# EAGLE design maple-protoshield-v0.1 (EAGLE 5.10)
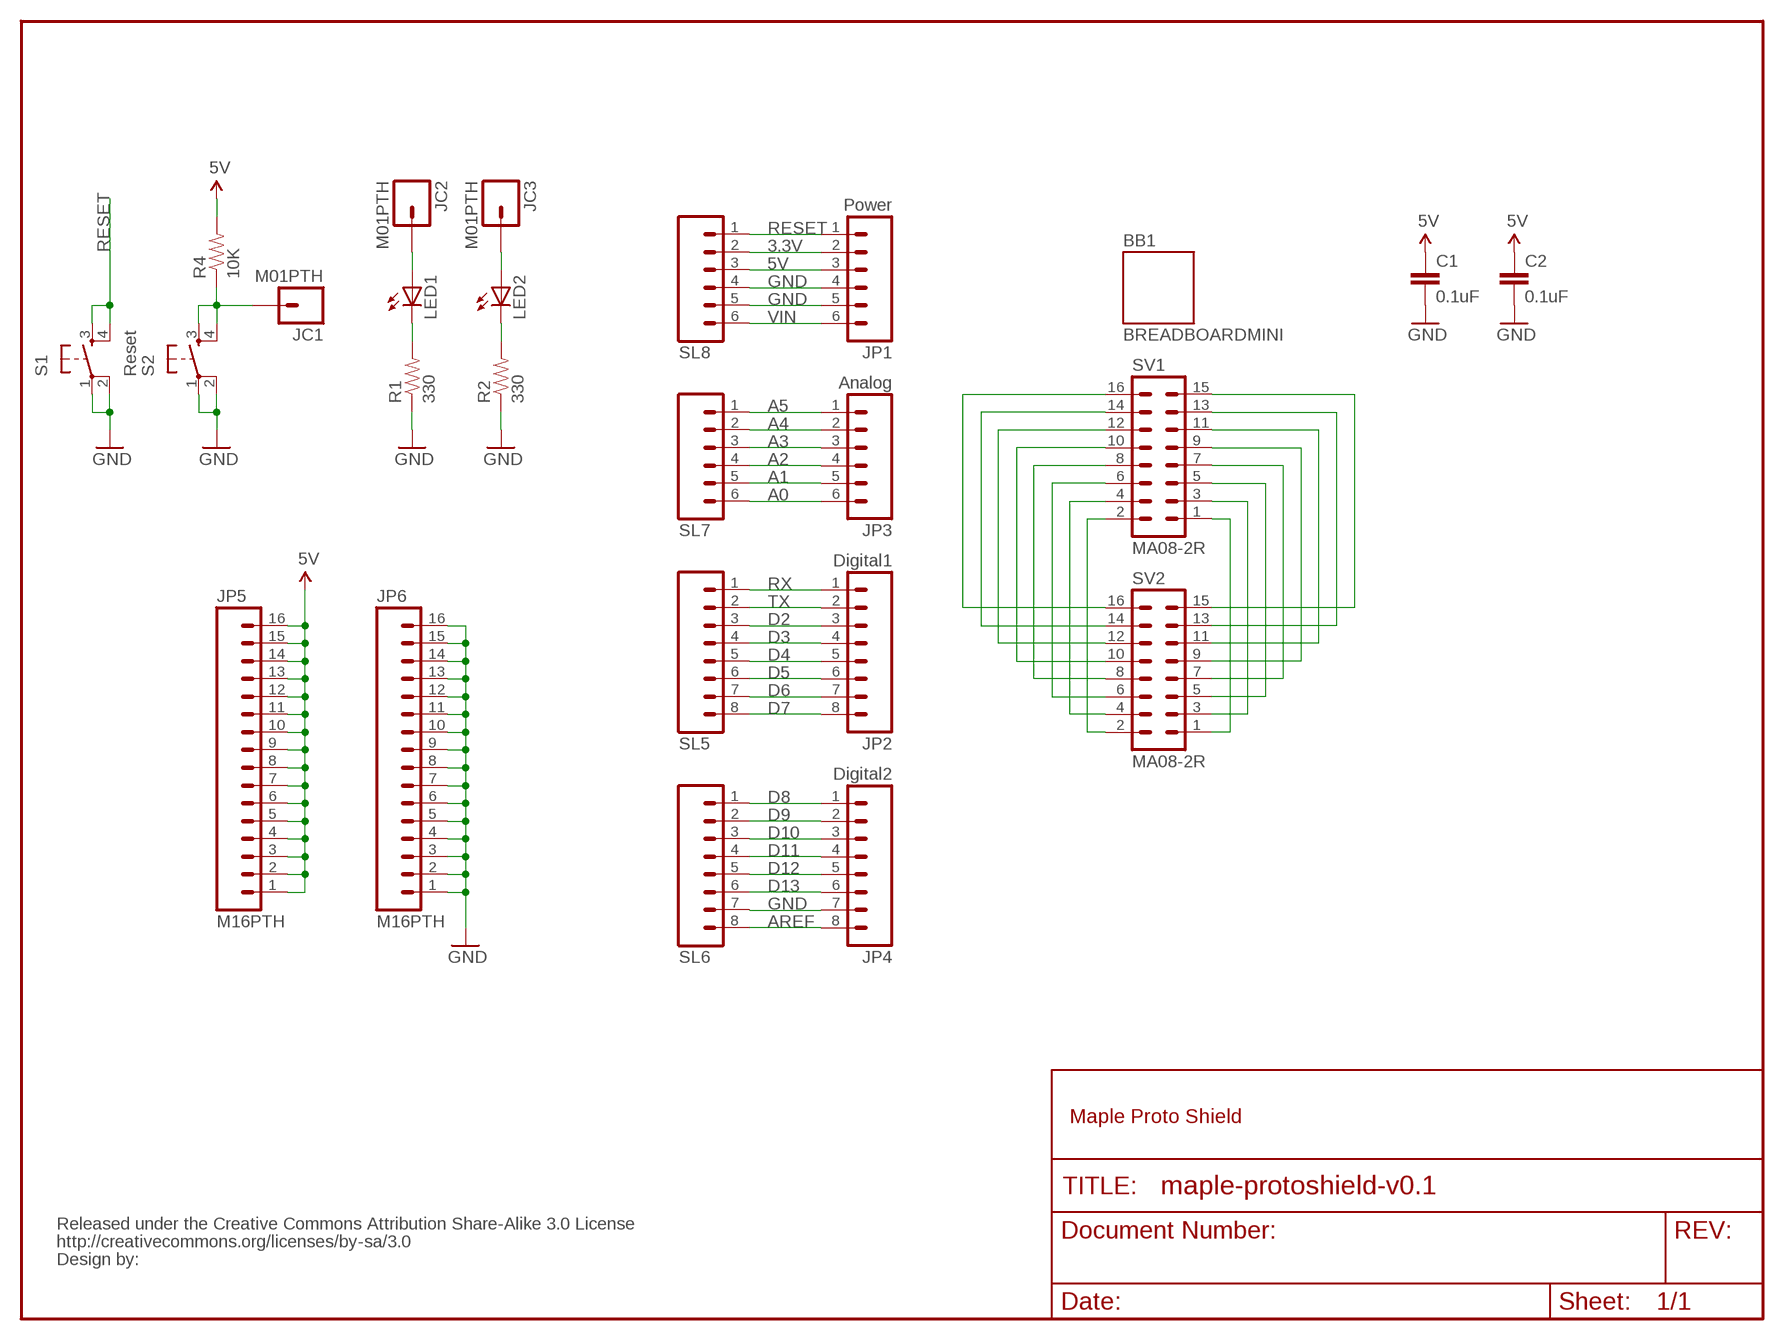
[diagram p0: schematic, sheet 1]

## Parts
BB1  BREADBOARDMINI  [BREADBOARD-MINI]
C1  0.1uF  CAPPTH2  [CAP-PTH-SMALL2]
C2  0.1uF  CAPPTH2  [CAP-PTH-SMALL2]
JC1  M01PTH  [1X01]
JC2  M01PTH  [1X01]
JC3  M01PTH  [1X01]
JP1  Power  M06SIP  [1X06]
JP2  Digital1  M08  [1X08]
JP3  Analog  M06SIP  [1X06]
JP4  Digital2  M08  [1X08]
JP5  M16PTH  [1X16]
JP6  M16PTH  [1X16]
LED1  LED5MM  [LED5MM]
LED2  LED5MM  [LED5MM]
R1  330  RESISTORPTH1  [AXIAL-0.3]
R2  330  RESISTORPTH1  [AXIAL-0.3]
R4  10K  RESISTORPTH1  [AXIAL-0.3]
S1  Reset  TAC_SWITCHPTH  [TACTILE-PTH]
S2  TAC_SWITCHPTH  [TACTILE-PTH]
SL5  M08  [1X08]
SL6  M08  [1X08]
SL7  M06SIP  [1X06]
SL8  M06SIP  [1X06]
SV1  MA08-2R  [MA08-2R]
SV2  MA08-2R  [MA08-2R]
U$2  CREATIVE_COMMONS  [CREATIVE_COMMONS]

## Nets
3.3V: JP1.2 SL8.2
5V [power]: C1.1 C2.1 JP1.3 JP5.1 JP5.2 JP5.3 JP5.4 JP5.5 JP5.6 JP5.7 JP5.8 JP5.9 JP5.10 JP5.11 JP5.12 JP5.13 JP5.14 JP5.15 JP5.16 R4.P$2 SL8.3
A0: JP3.6 SL7.6
A1: JP3.5 SL7.5
A2: JP3.4 SL7.4
A3: JP3.3 SL7.3
A4: JP3.2 SL7.2
A5: JP3.1 SL7.1
AREF: JP4.8 SL6.8
D2: JP2.3 SL5.3
D3: JP2.4 SL5.4
D4: JP2.5 SL5.5
D5: JP2.6 SL5.6
D6: JP2.7 SL5.7
D7: JP2.8 SL5.8
D8: JP4.1 SL6.1
D9: JP4.2 SL6.2
D10: JP4.3 SL6.3
D11: JP4.4 SL6.4
D12: JP4.5 SL6.5
D13: JP4.6 SL6.6
GND [power]: C1.2 C2.2 JP1.4 JP1.5 JP4.7 JP6.1 JP6.2 JP6.3 JP6.4 JP6.5 JP6.6 JP6.7 JP6.8 JP6.9 JP6.10 JP6.11 JP6.12 JP6.13 JP6.14 JP6.15 JP6.16 R1.P$1 R2.P$1 S1.1 S1.2 S2.1 S2.2 SL6.7 SL8.4 SL8.5
N$2: JC1.1 R4.P$1 S2.3 S2.4
N$6: LED1.K(C) R1.P$2
N$7: LED2.K(C) R2.P$2
N$8: JC2.1 LED1.A
N$9: JC3.1 LED2.A
N$39: SV1.1 SV2.1
N$183: SV1.3 SV2.3
N$184: SV1.5 SV2.5
N$185: SV1.7 SV2.7
N$186: SV1.9 SV2.9
N$187: SV1.11 SV2.11
N$188: SV1.13 SV2.13
N$189: SV1.15 SV2.15
N$190: SV1.2 SV2.2
N$191: SV1.4 SV2.4
N$192: SV1.6 SV2.6
N$193: SV1.8 SV2.8
N$194: SV1.10 SV2.10
N$195: SV1.12 SV2.12
N$196: SV1.14 SV2.14
N$197: SV1.16 SV2.16
RESET: JP1.1 S1.3 S1.4 SL8.1
RX: JP2.1 SL5.1
TX: JP2.2 SL5.2
VIN [power]: JP1.6 SL8.6

## Notes on the sheet
- Maple Proto Shield

## Library data of the parts
BB1 = SparkFun:BREADBOARD: Breadboard Mini Self Adhesive This is the mechnical outline for the very small self adhesive breadboard from SparkFun Electronics. Good for very small proto areas. SKU : PRT-07916
C1 C2 = SparkFun:CAP: Capacitor Standard 0603 ceramic capacitor, and 0.1" leaded capacitor.
JC1-JC3 = SparkFun:M01: Header 1 Standard 1-pin 0.1" header. Use with straight break away headers (SKU : PRT-00116), right angle break away headers (PRT-00553), swiss pins (PRT-00743), machine pins (PRT-00117), and female headers (PRT-00115).
JP1 JP3 SL7 SL8 = SparkFun:M06: Header 6 Standard 6-pin 0.1" header. Use with straight break away headers (SKU : PRT-00116), right angle break away headers (PRT-00553), swiss pins (PRT-00743), machine pins (PRT-00117), and female headers (PRT-00115). Molex polarized connector foot print use with SKU : PRT-08094 with associated crimp pins and housings. NOTES ON THE VARIANTS LOCK and LOCK_LONGPADS... This footprint was designed to help hold the alignment of a through-hole component (i.e. 6-pin header) while soldering it into place. You may notice that each hole has been shifted either up or down by 0.005 of an inch from it's more standard position (which is a perfectly straight line). This slight alteration caused the pins (the squares in the middle) to touch the edges of the holes. Because they are alternating, it causes a "brace" to hold the component in place. 0.005 has proven to be the perfect amount of "off-center" position when using our standard breakaway headers. Although looks a little odd when you look at the bare footprint, once you have a header in there, the alteration is very hard to notice. Also, if you push a header all the way into place, it is covered up entirely on the bottom side. This idea of altering the position of holes to aid alignment will be further integrated into the Sparkfun Library for other footprints. It can help hold any component with 3 or more connection pins.
JP2 JP4 SL5 SL6 = SparkFun:M08: Header 8 Standard 8-pin 0.1" header. Use with straight break away headers (SKU : PRT-00116), right angle break away headers (PRT-00553), swiss pins (PRT-00743), machine pins (PRT-00117), and female headers (PRT-00115).
JP5 JP6 = SparkFun:M16
LED1 LED2 = SparkFun:LED: LEDs Standard schematic elements and footprints for 5mm, 3mm, 1206, and 0603 sized LEDs. 5mm - Spark Fun Electronics SKU : COM-00529 (and others)
R1 R2 R4 = SparkFun:RESISTOR: Resistor Basic schematic elements and footprints for 0603, 1206, and PTH 1/10th watt (small) resistors.
S1 S2 = SparkFun:TAC_SWITCH: Momentary Switch Button commonly used for reset or general input. Spark Fun Electronics SKU : COM-00097
SV1 SV2 = con-lstb:MA08-2R: PIN HEADER
U$2 = SparkFun:CREATIVE_COMMONS

## Net classes
1 power: width 0.254 mm

## Board
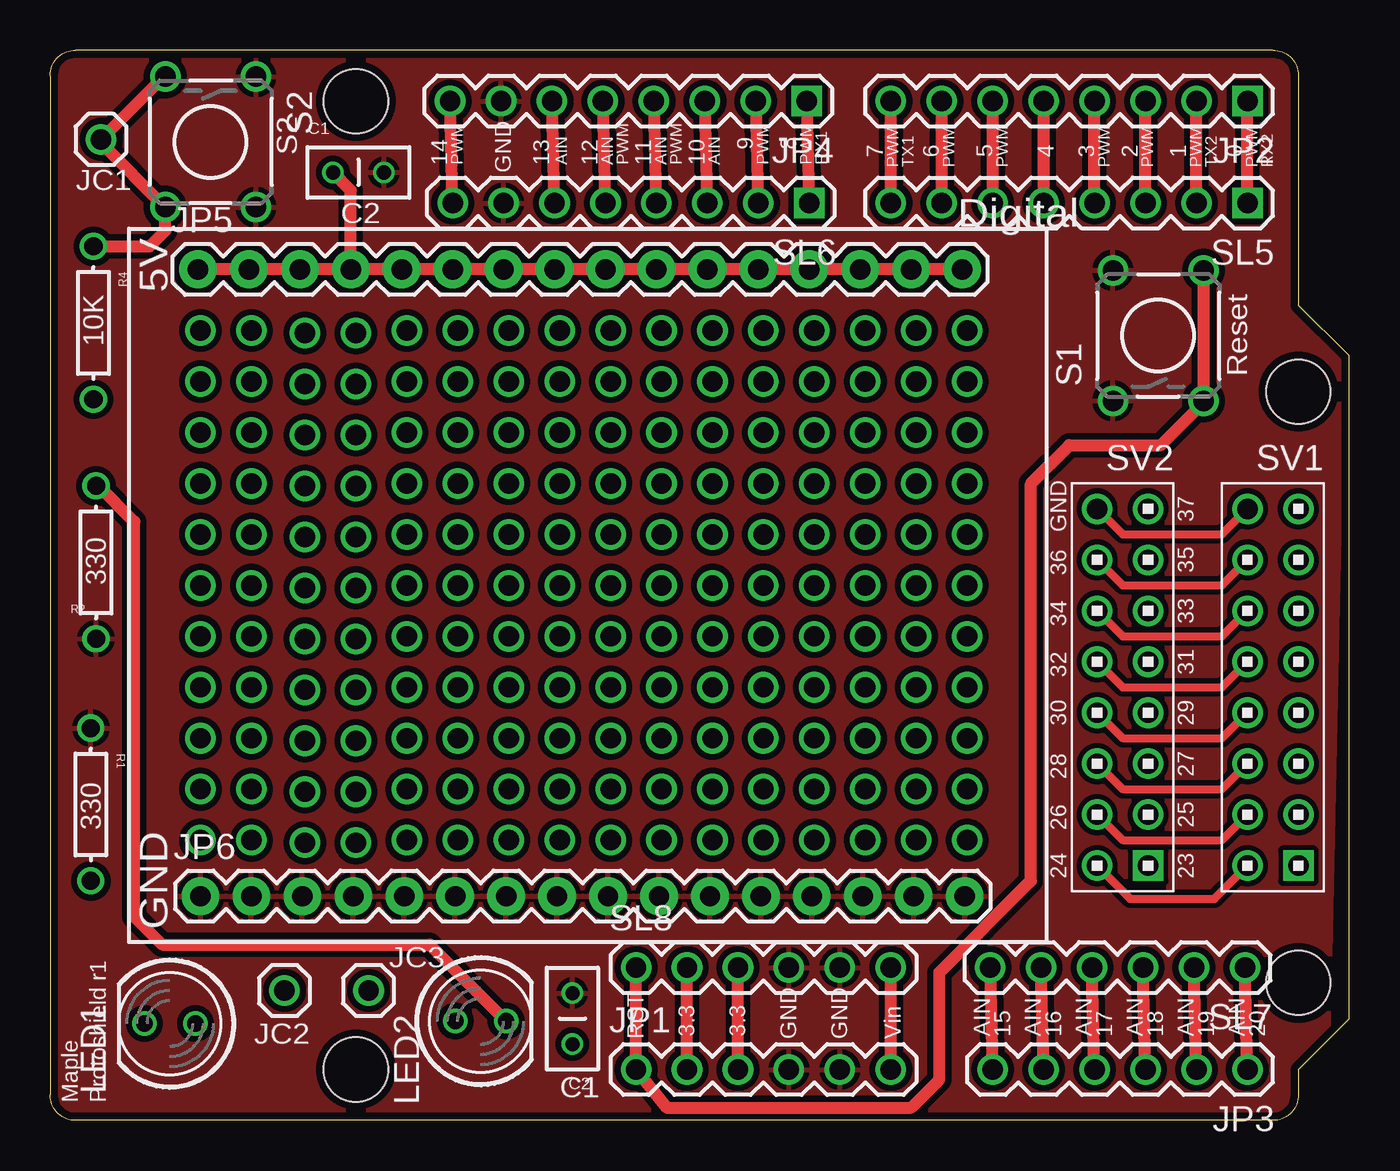
[diagram p1: board, top side]
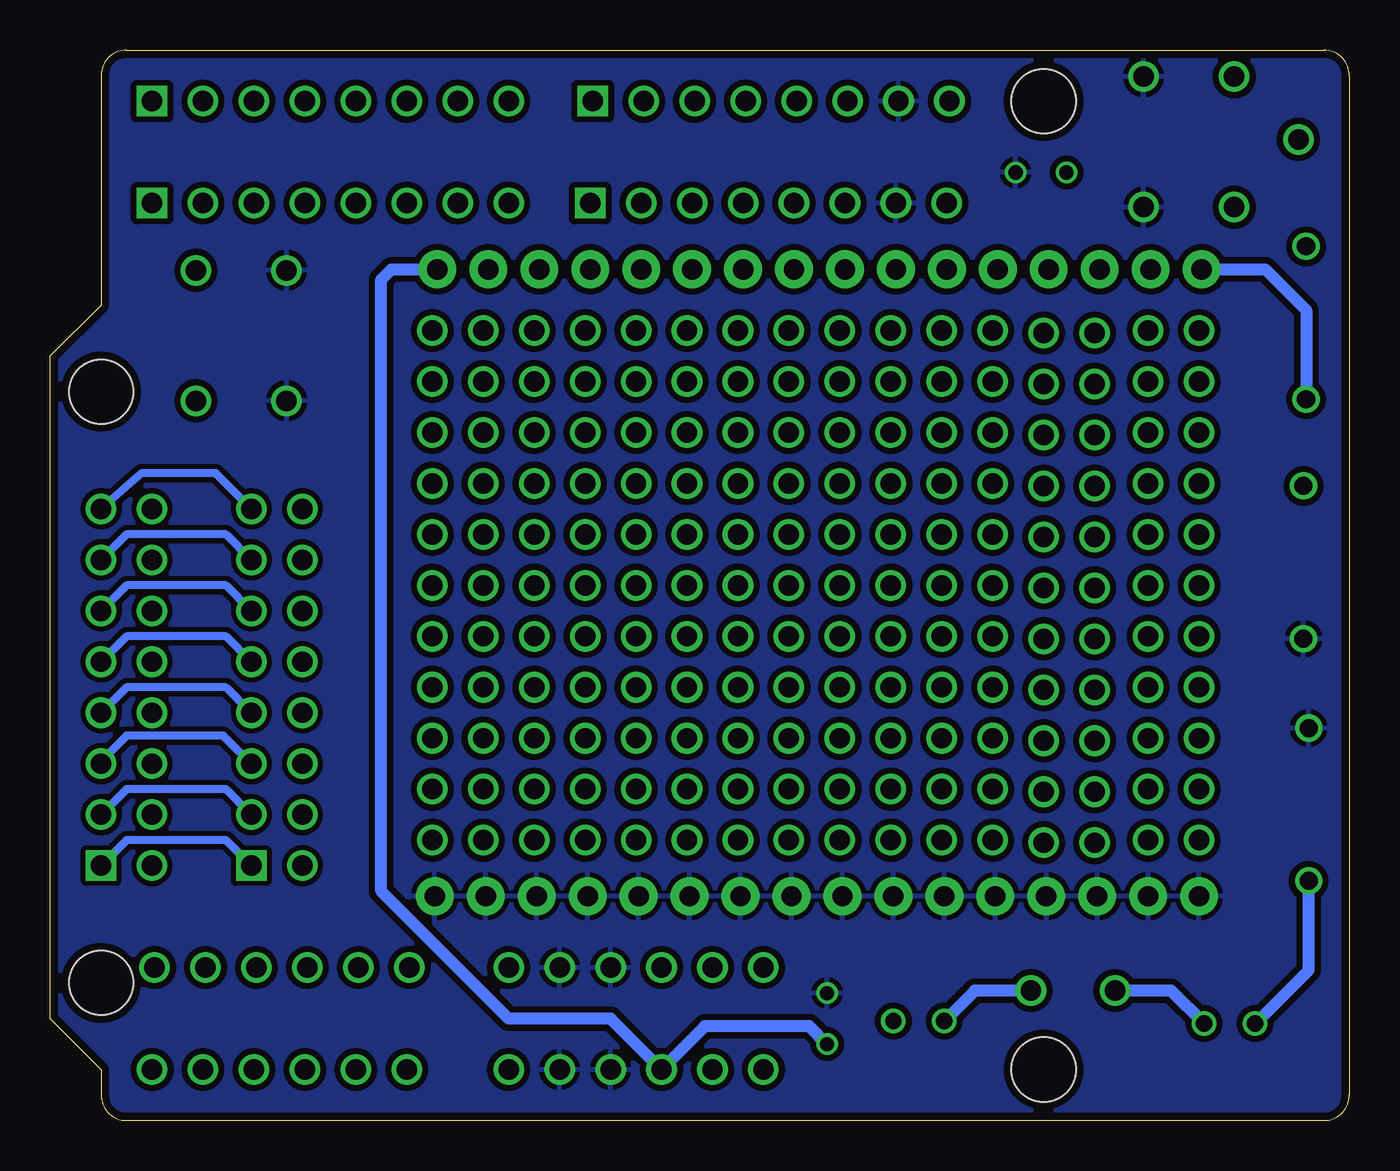
[diagram p2: board, bottom side, seen from below]

Size 64.77 x 53.34 mm. Coordinates in mm from the lower left corner, seen from the top.
Outline: 64.77,38.1 62.23,40.64 62.23,52.07 arc90 60.96,53.34 1.27,53.34 arc90 0,52.07 0,1.27 arc90 1.27,0 60.96,0 arc90 62.23,1.27 62.23,2.54 64.77,5.08 64.77,38.1
Copper layers (1*16): Top 0.0356mm / dielectric 1.5011mm / Bottom 0.0356mm
Design rules "LaenPCBOrder": minimum track width 6mil, minimum drill 13mil, track to track 6mil, track to pad 6mil, pad to pad 6mil, via to via 6mil, smd to smd 6mil, copper to edge 15mil, drill to drill 6mil, minimum pad ring 7mil, minimum via ring 7mil, stop-mask expansion 4mil, vias tented up to drill 0mil, thermal gap 10mil
Holes 3.2 mm at 62.23,6.86 15.24,50.8 62.23,36.32 15.24,2.54

### Footprints (pad centres in the part's own frame; a part is rotated, then mirrored left to right if it is on the bottom)
CAP-PTH-SMALL2 = drill 0.7 round: 1 0,0; 2 2.54,0
1X01 = drill 1.016 round: 1 0,0
1X06 = drill 1.016 round: 1 0,0; 2 2.54,0; 3 5.08,0; 4 7.62,0; 5 10.16,0; 6 12.7,0
1X08 = drill 1.016 square: 1 0,0 | drill 1.016 round: 2 2.54,0; 3 5.08,0; 4 7.62,0; 5 10.16,0; 6 12.7,0; 7 15.24,0; 8 17.78,0
1X16 = drill 1.016 pad 1.88 round: 1 0,0; 2 2.54,0; 3 5.08,0; 4 7.62,0; 5 10.16,0; 6 12.7,0; 7 15.24,0; 8 17.78,0; 9 20.32,0; 10 22.86,0; 11 25.4,0; 12 27.94,0; 13 30.48,0; 14 33.02,0; 15 35.56,0; 16 38.1,0
LED5MM = drill 0.813 round: A -1.27,0; K 1.27,0
AXIAL-0.3 = drill 0.9 round: P$1 -3.81,0; P$2 3.81,0
TACTILE-PTH = drill 1.016 round: 1 -3.251,2.261; 2 3.251,2.261; 3 -3.251,-2.261; 4 3.251,-2.261
MA08-2R = drill 1.016 square: 1 -8.89,-1.27 | drill 1.016 round: 2 -8.89,1.27; 3 -6.35,-1.27; 4 -6.35,1.27; 5 -3.81,-1.27; 6 -3.81,1.27; 7 -1.27,-1.27; 8 -1.27,1.27; 9 1.27,-1.27; 10 1.27,1.27; 11 3.81,-1.27; 12 3.81,1.27; 13 6.35,-1.27; 14 6.35,1.27; 15 8.89,-1.27; 16 8.89,1.27

### Placement (x,y rotation side)
BB1  3.94,8.89 0 top
C1  14.1,47.24 0 top
C2  26.04,3.81 90 top
JC1  2.54,48.89 0 top
JC2  11.68,6.48 180 top
JC3  15.87,6.48 270 top
JP1  29.21,2.54 0 top
JP2  59.69,50.8 180 top
JP3  59.69,2.54 180 top
JP4  37.72,50.8 180 top
JP5  7.37,42.42 0 top
JP6  7.49,11.18 0 top
LED1  5.97,4.83 180 top
LED2  21.46,4.95 0 top
R1  2.03,15.75 270 top
R2  2.29,27.81 90 top
R4  2.16,39.75 270 top
S1  55.25,39.12 90 top
S2  8,48.77 270 top
SL5  59.69,45.72 180 top
SL6  37.85,45.72 180 top
SL7  59.56,7.62 180 top
SL8  29.21,7.62 0 top
SV1  60.96,21.59 90 top
SV2  53.47,21.59 90 top
U$2  7.37,-10.16 0 top  (outside the outline)

### Tracks (layer width: path | path; a pad name or v marks a point on that pad's centre or on a via)
3.3V
  Top 0.61: JP1.2 SL8.2
5V
  Top 0.254: JP5.4 15.24,43.18
  Top 0.61: JP5.1 JP5.2 JP5.3 JP5.4 | JP5.4 JP5.5 JP5.6 JP5.7 JP5.8 JP5.9 JP5.10 JP5.11 JP5.12 JP5.13 JP5.14 JP5.15 JP5.16 | JP1.3 SL8.3 | C1.1 14.99,46.35 JP5.4
  Bottom 0.61: C2.1 26.92,4.7 32.13,4.7 JP1.3 36.83,5.08 41.91,5.08 48.26,11.43 48.26,41.91 47.75,42.42 JP5.16 | JP5.1 4.19,42.42 2.16,40.39 R4.P$2
A0
  Top 0.61: JP3.6 SL7.6
A1
  Top 0.61: JP3.5 SL7.5
A2
  Top 0.61: JP3.4 SL7.4
A3
  Top 0.61: JP3.3 SL7.3
A4
  Top 0.61: JP3.2 SL7.2
A5
  Top 0.61: JP3.1 SL7.1
AREF
  Top 0.61: SL6.8 JP4.8
D2
  Top 0.61: SL5.3 JP2.3
D3
  Top 0.61: SL5.4 JP2.4
D4
  Top 0.61: SL5.5 JP2.5
D5
  Top 0.61: SL5.6 JP2.6
D6
  Top 0.61: SL5.7 JP2.7
D7
  Top 0.61: SL5.8 JP2.8
D8
  Top 0.61: SL6.1 JP4.1
D9
  Top 0.61: SL6.2 JP4.2
D10
  Top 0.61: SL6.3 JP4.3
D11
  Top 0.61: SL6.4 JP4.4
D12
  Top 0.406: SL6.5 27.56,45.72
  Top 0.61: SL6.5 JP4.5
D13
  Top 0.61: SL6.6 JP4.6
GND
  pour Bottom (isolate 0.305): 65.53,53.85 64.39,0.25 0.51,-0.51 0.38,53.09
  pour Top (isolate 0.305): 64.77,53.59 63.63,0.13 0.13,0.13 -0.13,53.47
N$1  (via drill 1.02)
  other vias: 12.7,39.24
N$2
  Top 0.61: S2.3 5.66,52.02 JC1.1 2.54,48.72 S2.4 5.74,44.35 4.95,43.56 R4.P$1
N$3  (via drill 1.02)
  other vias: 12.7,36.7
N$4  (via drill 1.02)
  other vias: 12.7,13.84
N$5  (via drill 1.02)
  other vias: 12.7,16.38
N$6
  Bottom 0.61: R1.P$2 2.03,7.49 LED1.K
N$7
  Top 0.61: R2.P$2 2.41,31.62 4.19,29.84 4.19,10.16 5.59,8.76 18.92,8.76 LED2.K
N$8
  Bottom 0.61: JC2.1 8.89,6.48 LED1.A
N$9
  Bottom 0.61: JC3.1 18.67,6.48 LED2.A
N$10  (via drill 1.02)
  other vias: 12.7,18.92
N$11  (via drill 1.02)
  other vias: 12.7,21.46
N$12  (via drill 1.02)
  other vias: 12.7,24
N$13  (via drill 1.02)
  other vias: 12.7,26.54
N$14  (via drill 1.02)
  other vias: 12.7,29.08
N$15  (via drill 1.02)
  other vias: 12.7,31.62
N$16  (via drill 1.02)
  other vias: 12.7,34.16
N$17  (via drill 1.02)
  other vias: 10.03,39.37
N$18  (via drill 1.02)
  other vias: 10.03,36.83
N$19  (via drill 1.02)
  other vias: 10.03,13.97
N$20  (via drill 1.02)
  other vias: 10.03,16.51
N$21  (via drill 1.02)
  other vias: 10.03,19.05
N$22  (via drill 1.02)
  other vias: 10.03,21.59
N$23  (via drill 1.02)
  other vias: 10.03,24.13
N$24  (via drill 1.02)
  other vias: 10.03,26.67
N$25  (via drill 1.02)
  other vias: 10.03,29.21
N$26  (via drill 1.02)
  other vias: 10.03,31.75
N$27  (via drill 1.02)
  other vias: 10.03,34.29
N$28  (via drill 1.02)
  other vias: 7.49,39.37
N$29  (via drill 1.02)
  other vias: 7.49,36.83
N$30  (via drill 1.02)
  other vias: 7.49,13.97
N$31  (via drill 1.02)
  other vias: 7.49,16.51
N$32  (via drill 1.02)
  other vias: 7.49,19.05
N$33  (via drill 1.02)
  other vias: 7.49,21.59
N$34  (via drill 1.02)
  other vias: 7.49,24.13
N$35  (via drill 1.02)
  other vias: 7.49,26.67
N$36  (via drill 1.02)
  other vias: 7.49,29.21
N$37  (via drill 1.02)
  other vias: 7.49,31.75
N$38  (via drill 1.02)
  other vias: 7.49,34.29
N$39
  Bottom 0.406: SV1.1 60.96,13.97 56.01,13.97 SV2.1
N$40  (via drill 1.02)
  other vias: 15.24,39.24
N$41  (via drill 1.02)
  other vias: 15.24,36.7
N$42  (via drill 1.02)
  other vias: 15.24,13.84
N$43  (via drill 1.02)
  other vias: 15.24,16.38
N$44  (via drill 1.02)
  other vias: 15.24,18.92
N$45  (via drill 1.02)
  other vias: 15.24,21.46
N$46  (via drill 1.02)
  other vias: 15.24,24
N$47  (via drill 1.02)
  other vias: 15.24,26.54
N$48  (via drill 1.02)
  other vias: 15.24,29.08
N$49  (via drill 1.02)
  other vias: 15.24,31.62
N$50  (via drill 1.02)
  other vias: 15.24,34.16
N$51  (via drill 1.02)
  other vias: 45.72,39.37
N$52  (via drill 1.02)
  other vias: 45.72,36.83
N$53  (via drill 1.02)
  other vias: 45.72,13.97
N$54  (via drill 1.02)
  other vias: 45.72,16.51
N$55  (via drill 1.02)
  other vias: 45.72,19.05
N$56  (via drill 1.02)
  other vias: 45.72,21.59
N$57  (via drill 1.02)
  other vias: 45.72,24.13
N$58  (via drill 1.02)
  other vias: 45.72,26.67
N$59  (via drill 1.02)
  other vias: 45.72,29.21
N$60  (via drill 1.02)
  other vias: 45.72,31.75
N$61  (via drill 1.02)
  other vias: 45.72,34.29
N$62  (via drill 1.02)
  other vias: 43.18,39.37
N$63  (via drill 1.02)
  other vias: 43.18,36.83
N$64  (via drill 1.02)
  other vias: 43.18,13.97
N$65  (via drill 1.02)
  other vias: 43.18,16.51
N$66  (via drill 1.02)
  other vias: 43.18,19.05
N$67  (via drill 1.02)
  other vias: 43.18,21.59
N$68  (via drill 1.02)
  other vias: 43.18,24.13
N$69  (via drill 1.02)
  other vias: 43.18,26.67
N$70  (via drill 1.02)
  other vias: 43.18,29.21
N$71  (via drill 1.02)
  other vias: 43.18,31.75
N$72  (via drill 1.02)
  other vias: 43.18,34.29
N$73  (via drill 1.02)
  other vias: 40.64,39.37
N$74  (via drill 1.02)
  other vias: 40.64,36.83
N$75  (via drill 1.02)
  other vias: 40.64,13.97
N$76  (via drill 1.02)
  other vias: 40.64,16.51
N$77  (via drill 1.02)
  other vias: 40.64,19.05
N$78  (via drill 1.02)
  other vias: 40.64,21.59
N$79  (via drill 1.02)
  other vias: 40.64,24.13
N$80  (via drill 1.02)
  other vias: 40.64,26.67
N$81  (via drill 1.02)
  other vias: 40.64,29.21
N$82  (via drill 1.02)
  other vias: 40.64,31.75
N$83  (via drill 1.02)
  other vias: 40.64,34.29
N$84  (via drill 1.02)
  other vias: 38.1,39.37
N$85  (via drill 1.02)
  other vias: 38.1,36.83
N$86  (via drill 1.02)
  other vias: 38.1,13.97
N$87  (via drill 1.02)
  other vias: 38.1,16.51
N$88  (via drill 1.02)
  other vias: 38.1,19.05
N$89  (via drill 1.02)
  other vias: 38.1,21.59
N$90  (via drill 1.02)
  other vias: 38.1,24.13
N$91  (via drill 1.02)
  other vias: 38.1,26.67
N$92  (via drill 1.02)
  other vias: 38.1,29.21
N$93  (via drill 1.02)
  other vias: 38.1,31.75
N$94  (via drill 1.02)
  other vias: 38.1,34.29
N$95  (via drill 1.02)
  other vias: 35.56,39.37
N$96  (via drill 1.02)
  other vias: 35.56,36.83
N$97  (via drill 1.02)
  other vias: 35.56,13.97
N$98  (via drill 1.02)
  other vias: 35.56,16.51
N$99  (via drill 1.02)
  other vias: 35.56,19.05
N$100  (via drill 1.02)
  other vias: 35.56,21.59
N$101  (via drill 1.02)
  other vias: 35.56,24.13
N$102  (via drill 1.02)
  other vias: 35.56,26.67
N$103  (via drill 1.02)
  other vias: 35.56,29.21
N$104  (via drill 1.02)
  other vias: 35.56,31.75
N$105  (via drill 1.02)
  other vias: 35.56,34.29
N$106  (via drill 1.02)
  other vias: 33.02,39.37
N$107  (via drill 1.02)
  other vias: 33.02,36.83
N$108  (via drill 1.02)
  other vias: 33.02,13.97
N$109  (via drill 1.02)
  other vias: 33.02,16.51
N$110  (via drill 1.02)
  other vias: 33.02,19.05
N$111  (via drill 1.02)
  other vias: 33.02,21.59
N$112  (via drill 1.02)
  other vias: 33.02,24.13
N$113  (via drill 1.02)
  other vias: 33.02,26.67
N$114  (via drill 1.02)
  other vias: 33.02,29.21
N$115  (via drill 1.02)
  other vias: 33.02,31.75
N$116  (via drill 1.02)
  other vias: 33.02,34.29
N$117  (via drill 1.02)
  other vias: 30.48,39.37
N$118  (via drill 1.02)
  other vias: 30.48,36.83
N$119  (via drill 1.02)
  other vias: 30.48,13.97
N$120  (via drill 1.02)
  other vias: 30.48,16.51
N$121  (via drill 1.02)
  other vias: 30.48,19.05
N$122  (via drill 1.02)
  other vias: 30.48,21.59
N$123  (via drill 1.02)
  other vias: 30.48,24.13
N$124  (via drill 1.02)
  other vias: 30.48,26.67
N$125  (via drill 1.02)
  other vias: 30.48,29.21
N$126  (via drill 1.02)
  other vias: 30.48,31.75
N$127  (via drill 1.02)
  other vias: 30.48,34.29
N$128  (via drill 1.02)
  other vias: 27.94,39.37
N$129  (via drill 1.02)
  other vias: 27.94,36.83
N$130  (via drill 1.02)
  other vias: 27.94,13.97
N$131  (via drill 1.02)
  other vias: 27.94,16.51
N$132  (via drill 1.02)
  other vias: 27.94,19.05
N$133  (via drill 1.02)
  other vias: 27.94,21.59
N$134  (via drill 1.02)
  other vias: 27.94,24.13
N$135  (via drill 1.02)
  other vias: 27.94,26.67
N$136  (via drill 1.02)
  other vias: 27.94,29.21
N$137  (via drill 1.02)
  other vias: 27.94,31.75
N$138  (via drill 1.02)
  other vias: 27.94,34.29
N$139  (via drill 1.02)
  other vias: 25.4,39.37
N$140  (via drill 1.02)
  other vias: 25.4,36.83
N$141  (via drill 1.02)
  other vias: 25.4,13.97
N$142  (via drill 1.02)
  other vias: 25.4,16.51
N$143  (via drill 1.02)
  other vias: 25.4,19.05
N$144  (via drill 1.02)
  other vias: 25.4,21.59
N$145  (via drill 1.02)
  other vias: 25.4,24.13
N$146  (via drill 1.02)
  other vias: 25.4,26.67
N$147  (via drill 1.02)
  other vias: 25.4,29.21
N$148  (via drill 1.02)
  other vias: 25.4,31.75
N$149  (via drill 1.02)
  other vias: 25.4,34.29
N$150  (via drill 1.02)
  other vias: 22.86,39.37
N$151  (via drill 1.02)
  other vias: 22.86,36.83
N$152  (via drill 1.02)
  other vias: 22.86,13.97
N$153  (via drill 1.02)
  other vias: 22.86,16.51
N$154  (via drill 1.02)
  other vias: 22.86,19.05
N$155  (via drill 1.02)
  other vias: 22.86,21.59
N$156  (via drill 1.02)
  other vias: 22.86,24.13
N$157  (via drill 1.02)
  other vias: 22.86,26.67
N$158  (via drill 1.02)
  other vias: 22.86,29.21
N$159  (via drill 1.02)
  other vias: 22.86,31.75
N$160  (via drill 1.02)
  other vias: 22.86,34.29
N$161  (via drill 1.02)
  other vias: 20.32,39.37
N$162  (via drill 1.02)
  other vias: 20.32,36.83
N$163  (via drill 1.02)
  other vias: 20.32,13.97
N$164  (via drill 1.02)
  other vias: 20.32,16.51
N$165  (via drill 1.02)
  other vias: 20.32,19.05
N$166  (via drill 1.02)
  other vias: 20.32,21.59
N$167  (via drill 1.02)
  other vias: 20.32,24.13
N$168  (via drill 1.02)
  other vias: 20.32,26.67
N$169  (via drill 1.02)
  other vias: 20.32,29.21
N$170  (via drill 1.02)
  other vias: 20.32,31.75
N$171  (via drill 1.02)
  other vias: 20.32,34.29
N$172  (via drill 1.02)
  other vias: 17.78,39.37
N$173  (via drill 1.02)
  other vias: 17.78,36.83
N$174  (via drill 1.02)
  other vias: 17.78,13.97
N$175  (via drill 1.02)
  other vias: 17.78,16.51
N$176  (via drill 1.02)
  other vias: 17.78,19.05
N$177  (via drill 1.02)
  other vias: 17.78,21.59
N$178  (via drill 1.02)
  other vias: 17.78,24.13
N$179  (via drill 1.02)
  other vias: 17.78,26.67
N$180  (via drill 1.02)
  other vias: 17.78,29.21
N$181  (via drill 1.02)
  other vias: 17.78,31.75
N$182  (via drill 1.02)
  other vias: 17.78,34.29
N$183
  Bottom 0.406: SV1.3 60.96,16.51 56.01,16.51 SV2.3
N$184
  Bottom 0.406: SV1.5 62.23,17.91 60.96,19.18 56.13,19.18 SV2.5
N$185
  Bottom 0.406: SV1.7 60.96,21.59 56.01,21.59 SV2.7
N$186
  Bottom 0.406: SV1.9 60.96,24.13 56.01,24.13 SV2.9
N$187
  Bottom 0.406: SV1.11 60.96,26.67 56.01,26.67 SV2.11
N$188
  Bottom 0.406: SV1.13 60.96,29.21 56.01,29.21 SV2.13
N$189
  Bottom 0.406: SV1.15 60.2,32.26 56.52,32.26 SV2.15
N$190
  Top 0.406: SV2.2 53.85,11.05 58.04,11.05 SV1.2
N$191
  Top 0.406: SV2.4 53.47,13.97 58.42,13.97 SV1.4
N$192
  Top 0.406: SV2.6 53.47,16.51 58.42,16.51 SV1.6
N$193
  Top 0.406: SV2.8 53.47,19.05 58.42,19.05 SV1.8
N$194
  Top 0.406: SV2.10 53.47,21.59 58.42,21.59 SV1.10
N$195
  Top 0.406: SV2.12 53.47,24.13 58.42,24.13 SV1.12
N$196
  Top 0.406: SV2.14 53.47,26.67 58.42,26.67 SV1.14
N$197
  Top 0.406: SV2.16 53.47,29.21 58.42,29.21 SV1.16
N$198
  pour Top (isolate 0.254): 50.67,32 63.75,32 63.75,10.16 50.67,10.16
N$199
  pour Bottom (isolate 0.254): 50.67,11.18 63.75,11.18 63.75,33.78 50.67,33.78
RESET
  Top 0.61: SL8.1 JP1.1 30.73,0.64 42.93,0.64 44.32,2.03 44.32,7.37 48.89,11.94 48.89,31.75 50.8,33.65 55.37,33.65 57.51,35.79 S1.3 S1.4
RX
  Top 0.61: SL5.1 JP2.1
TX
  Top 0.61: SL5.2 JP2.2
VIN
  Top 0.61: JP1.6 SL8.6

### Text on the board
tPlace: 9 | 8 | S2 | 14 | PWM | GND | 13 | AIN | 12 | AIN | PWM | 11 | AIN | PWM | 10 | AIN | PWM | PWM | RX1 | 7 | PWM | TX1 | 6 | PWM | 5 | PWM | 4 | 3 | PWM | 2 | PWM | 1 | PWM | TX2 | 0 | PWM | RX2 | JC1 | C2 | 5V | Reset | GND | 37 | 35 | 36 | 34 | 33 | 32 | 31 | 30 | 29 | 28 | 27 | 26 | 25 | 24 | 23 | GND | JC3 | JC2 | RST | 3.3 | 3.3 | GND | GND | Vin | AIN | 15 | AIN | 16 | AIN | 17 | AIN | 18 | AIN | 19 | AIN | 20 | Maple | Protoshield r1 | C1
tNames: Digital
tValues: Adam Feuer | Based on the Arduino ProtoShield by SparkFun Electronics and ITP @ NYU